# EAGLE design ffs_no_amp (EAGLE 7.2.0)
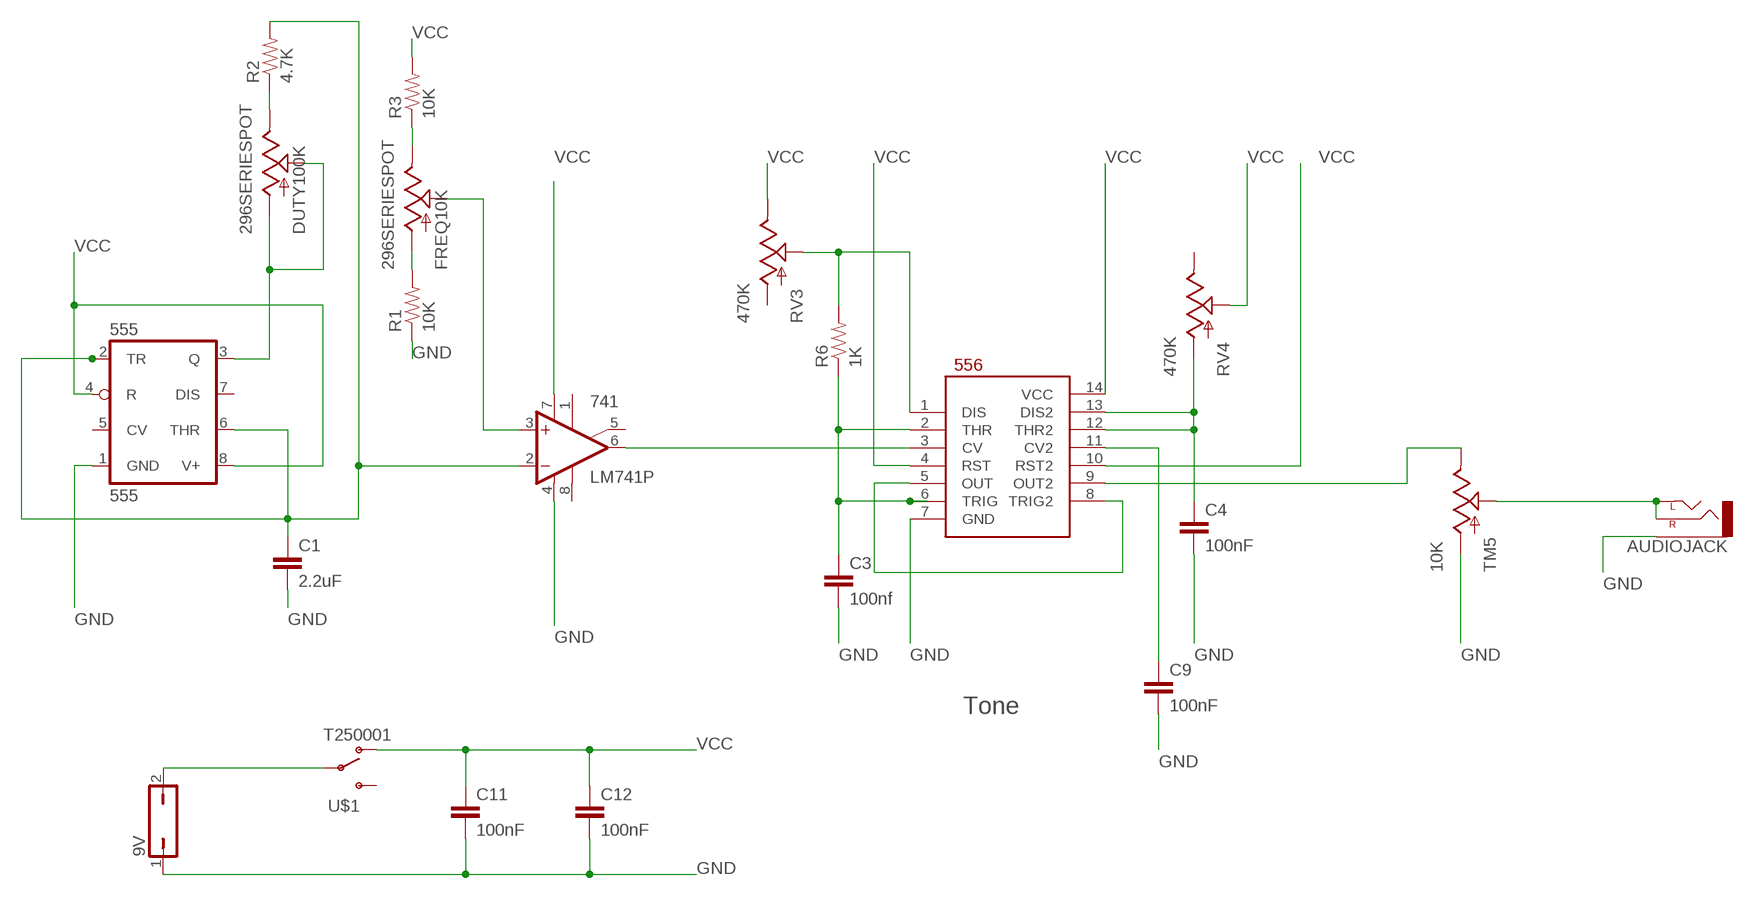
[diagram p0: schematic, sheet 1]

## Parts
9V  JP1Q  [JP1]
555  555  LM555N  [DIL08-ROUND]
556  556  [DIL14]
741  LM741P  [DIL08]
AUDIOJACK  AUDIO-JACKPTH  [AUDIO-JACK]
C1  2.2uF  CAPPTH1  [CAP-PTH-5MM]
C3  100nf  CAPPTH  [CAP-PTH-SMALL]
C4  100nF  CAPPTH  [CAP-PTH-SMALL]
C9  100nF  CAPPTH  [CAP-PTH-SMALL]
C11  100nF  CAPPTH  [CAP-PTH-SMALL]
C12  100nF  CAPPTH  [CAP-PTH-SMALL]
DUTY100K  296SERIESPOT  [296SERIESPOT]
FREQ10K  296SERIESPOT  [296SERIESPOT]
R1  10K  RESISTORPTH-1/4W  [AXIAL-0.4]
R2  4.7K  RESISTORPTH-1/4W  [AXIAL-0.4]
R3  10K  RESISTORPTH-1/4W  [AXIAL-0.4]
R6  1K  RESISTORPTH-1/4W  [AXIAL-0.4]
RV3  470K  296SERIESPOT  [296SERIESPOT]
RV4  470K  296SERIESPOT  [296SERIESPOT]
TM5  10K  296SERIESPOT  [296SERIESPOT]
U$1  T250001  [T250001]

## Nets
BATT: 9V.2 U$1.5(P)
GND: 9V.1 555.1(GND) 556.7(GND) 741.4(V-) AUDIOJACK.SLEEVE C1.2 C3.2 C4.2 C9.2 C11.2 C12.2 R1.P$1 TM5.PIN1(A)
N$1: 555.2(TR) 555.6(THR) 741.2(-IN) C1.1 R2.P$2
N$2: 556.9(OUT2) TM5.PIN3(E)
N$3: FREQ10K.PIN3(E) R3.P$1
N$4: AUDIOJACK.RING(RIGHT) AUDIOJACK.TIP(LEFT) TM5.PIN2(S)
N$5: FREQ10K.PIN1(A) R1.P$2
N$6: 556.1(DIS) R6.P$2 RV3.PIN2(S)
N$7: 556.3(CV) 741.6(OUT)
N$8: 556.2(THR) 556.6(TRIG) C3.1 R6.P$1
N$9: 556.5(OUT) 556.8(TRIG2)
N$10: 556.12(THR2) 556.13(DIS2) C4.1 RV4.PIN1(A)
N$13: 556.11(CV2) C9.1
N$14: 555.3(Q) DUTY100K.PIN1(A) DUTY100K.PIN2(S)
N$15: DUTY100K.PIN3(E) R2.P$1
N$17: 741.3(+IN) FREQ10K.PIN2(S)
VCC: 555.4(R) 555.8(V+) 556.4(RST) 556.10(RST2) 556.14(VCC) 741.7(V+) C11.1 C12.1 R3.P$2 RV3.PIN3(E) RV4.PIN2(S) U$1.4(O)
Unconnected: 555.5(CV) 555.7(DIS) 741.1(ON1) 741.5(ON2) 741.8(OPT) RV3.PIN1(A) RV4.PIN3(E) U$1.6(S)

## Notes on the sheet
- Tone

## Library data of the parts
9V = jumper:JP1Q: JUMPER
555 = adafruit:*555: TIMER Changed DIP package to have round (not oval) pin pads http://www.ladyada.net/library/pcb/eaglelibrary.html
556 = SparkFun-AnalogIC:556: Dual timer circuit (2 555 timers in one package)
741 = linear:*741: OP AMP
AUDIOJACK = SparkFun-Connectors:AUDIO-JACK: 3.5mm Audio Jack Simple 3.5mm common PCB mount audio jack. Variant PTH is our storefront SKU PRT-08032
C1 C3 C4 C9 C11 C12 = SparkFun-Capacitors:CAP: Capacitor Standard 0603 ceramic capacitor, and 0.1" leaded capacitor.
DUTY100K FREQ10K RV3 RV4 TM5 = 296seriesPOT:296SERIESPOT
R1-R3 = SparkFun-Resistors:RESISTOR: Resistor Basic schematic elements and footprints for 0603, 1206, and PTH resistors.
R6 = SparkFun-Passives:RESISTOR: Resistor Basic schematic elements and footprints for 0603, 1206, and PTH resistors.
U$1 = T250001:T250001

## Board
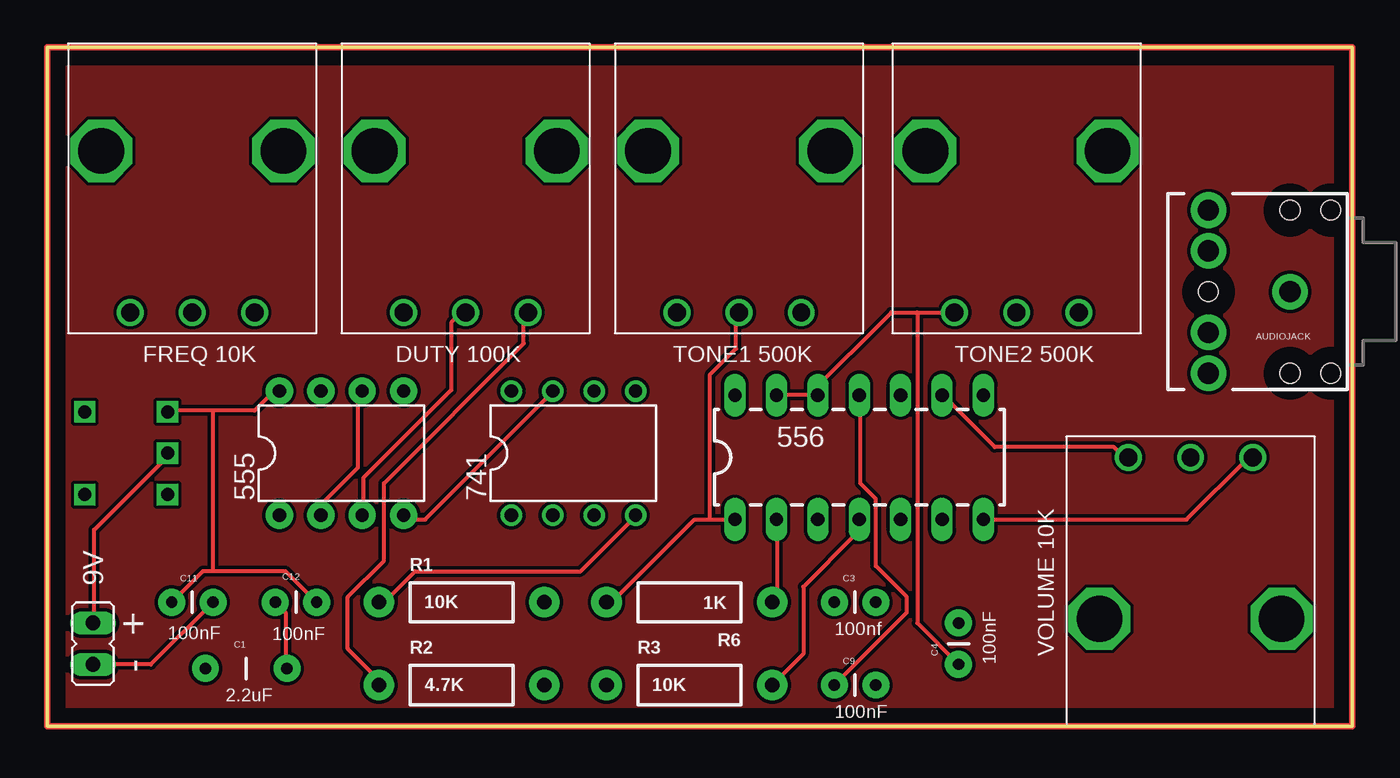
[diagram p1: board, top side]
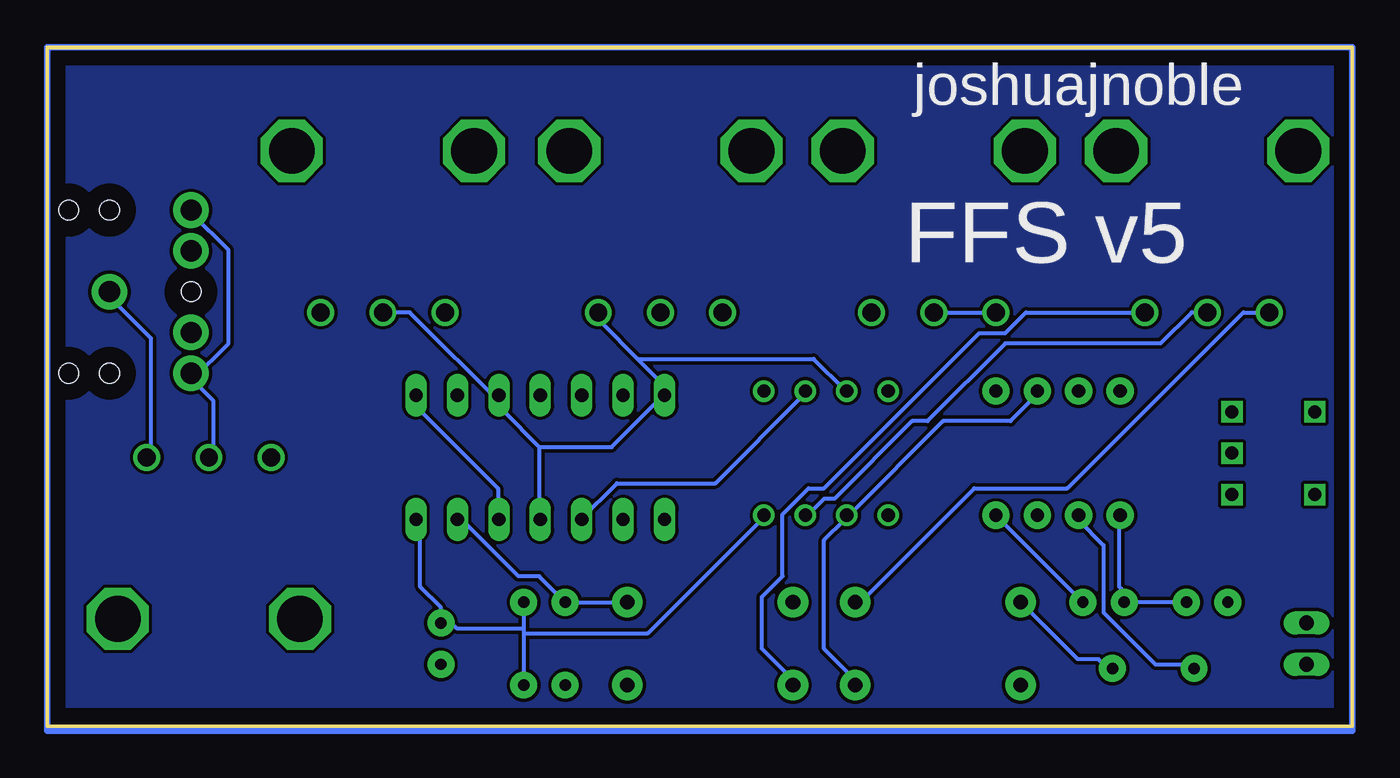
[diagram p2: board, bottom side, seen from below]

Size 80.01 x 41.66 mm. Coordinates in mm from the lower left corner, seen from the top.
Outline: 0,0 79.99,0 79.99,41.58 0,41.58 0,0
Outline: 0,0 80.01,0 80.01,41.66 0,41.66 0,0
Copper layers (1*16): Top 0.035mm / dielectric 1.5mm / Bottom 0.035mm
Design rules "default": minimum track width 10mil, minimum drill 24mil, track to track 8mil, track to pad 8mil, pad to pad 8mil, via to via 8mil, smd to smd 8mil, copper to edge 40mil, drill to drill 8mil, minimum pad ring 10mil, minimum via ring 8mil, stop-mask expansion 4mil, vias tented up to drill 0mil, thermal gap 10mil

### Footprints (pad centres in the part's own frame; a part is rotated, then mirrored left to right if it is on the bottom)
JP1 = drill 0.914 long: 1 0,-1.27; 2 0,1.27
DIL08-ROUND = drill 0.813 pad 1.676: 1 -3.81,-3.81; 2 -1.27,-3.81; 3 1.27,-3.81; 4 3.81,-3.81; 5 3.81,3.81; 6 1.27,3.81; 7 -1.27,3.81; 8 -3.81,3.81
DIL14 = drill 0.813 long: 1 -8.89,-3.81; 2 -6.35,-3.81; 3 -3.81,-3.81; 4 -1.27,-3.81; 5 1.27,-3.81; 6 3.81,-3.81; 7 6.35,-3.81; 8 6.35,3.81; 9 3.81,3.81; 10 1.27,3.81; 11 -1.27,3.81; 12 -3.81,3.81; 13 -6.35,3.81; 14 -8.89,3.81
DIL08 = drill 0.813 pad 1.27: 1 -3.81,-3.81; 2 -1.27,-3.81; 3 1.27,-3.81; 4 3.81,-3.81; 5 3.81,3.81; 6 1.27,3.81; 7 -1.27,3.81; 8 -3.81,3.81
AUDIO-JACK = drill 1.3 pad 2.184: RING 5,5; RSH 5,2.5; SLEEVE 0,0; TIP 5,-5; TSH 5,-2.5 | hole 1.2: 0,5; -2.5,5; -2.5,-5; 0,-5; 5,0
CAP-PTH-5MM = drill 0.7 pad 1.651: 1 -2.5,0; 2 2.5,0
CAP-PTH-SMALL = drill 0.7 pad 1.651: 1 0,0; 2 2.54,0
296SERIESPOT = drill 2.8 octagon: MOUNTL 9.906,-9.398; MOUNTR 9.906,1.778 | drill 1.1: PIN1 0,0; PIN2 0,-3.81; PIN3 0,-7.62
AXIAL-0.4 = drill 0.9 pad 1.88: P$1 -5.08,0; P$2 5.08,0
T250001 = drill 0.8 square: 4 5.08,0; 5 5.08,-2.54; 6 5.08,-5.08; P$1 0,0; P$2 0,-5.08

### Placement (x,y rotation side)
9V  2.79,5.08 0 top
555  18.03,16.76 0 top
556  51.05,16.51 0 top
741  32.26,16.76 0 top
AUDIOJACK  76.2,26.67 180 top
C1  12.19,3.56 0 top
C3  48.26,7.62 0 top
C4  55.88,3.81 90 top
C9  48.26,2.54 0 top
C11  7.62,7.62 0 top
C12  16.51,7.62 180 top
DUTY100K  21.84,25.4 90 top
FREQ10K  5.08,25.4 90 top
R1  25.4,7.62 0 top
R2  25.4,2.54 0 top
R3  39.37,2.54 0 top
R6  39.37,7.62 180 top
RV3  38.61,25.4 90 top
RV4  55.63,25.4 90 top
TM5  73.91,16.51 270 top
U$1  2.29,19.3 0 top

### Tracks (layer width: path | path; a pad name or v marks a point on that pad's centre or on a via)
BATT
  Top 0.254: U$1.5 7.3,16.51 2.86,12.07 2.86,6.35 9V.2
GND
  Top 0.254: R1.P$1 20.64,7.62 22.54,9.52 32.7,9.52 35.88,12.7 741.4 | 9V.1 6.35,3.81 C11.2 | C12.2 14.6,6.98 14.6,3.81 C1.2 | 556.7 69.85,12.7 73.66,16.51 TM5.PIN1
  Bottom 0.254: C11.2 13.33,7.62 | 13.33,7.62 14.29,8.57 14.29,12.7 555.1 | 13.33,7.62 C12.2 | R1.P$1 16.83,4.13 15.56,4.13 14.92,3.49 C1.2 | AUDIOJACK.SLEEVE 76.2,26.35 73.66,23.81 73.66,16.51 TM5.PIN1 | C3.2 50.8,6.03 | 50.8,6.03 50.8,5.71 | 50.8,5.71 C9.2 | 55.88,6.98 55.88,7.3 57.15,8.57 57.15,12.7 556.7 | 50.8,6.03 54.93,6.03 55.88,6.98 | 55.88,6.98 C4.2 | 50.8,5.71 43.18,5.71 36.2,12.7 741.4
N$1
  Top 0.254: 555.6 19.05,20.32 19.05,15.87 16.83,13.65 16.83,13.02 555.2
  Bottom 0.254: R2.P$2 30.48,2.86 32.38,4.76 32.38,11.43 31.11,12.7 741.2 30.8,13.02 25.08,18.73 20.96,18.73 19.37,20.32 555.6 | C1.1 9.84,3.81 12.06,3.81 15.24,6.98 15.24,11.11 16.83,12.7 555.2
N$2
  Top 0.254: 556.9 54.93,20.32 58.1,17.15 65.41,17.15 66.04,16.51 TM5.PIN3
N$3
  Bottom 0.254: FREQ10K.PIN3 20,25.4 21.27,24.13 22.86,24.13 32.38,14.6 33.34,14.6 34.92,13.02 34.92,9.21 36.2,7.94 36.2,4.76 34.29,2.86 R3.P$1
N$4
  Bottom 0.254: 71.12,21.27 71.44,21.59 AUDIOJACK.RING 71.12,21.27 | 71.12,21.27 69.85,20 69.85,16.51 TM5.PIN2 | 71.12,21.27 68.9,23.49 68.9,29.21 71.12,31.43 AUDIOJACK.TIP
N$5
  Bottom 0.254: FREQ10K.PIN1 6.67,25.4 17.46,14.6 23.18,14.6 30.16,7.62 R1.P$2
N$6
  Top 0.254: 40.64,12.7 39.69,12.7 34.61,7.62 R6.P$2 | 40.64,12.7 556.1 | 40.64,12.7 40.64,21.59 42.23,23.18 42.23,25.4 RV3.PIN2
N$7
  Bottom 0.254: 741.6 33.66,20.32 39.05,14.92 45.09,14.92 47.31,12.7 556.3
N$8
  Top 0.254: R6.P$1 44.77,7.94 44.77,12.7 556.2
  Bottom 0.254: 556.6 54.61,12.7 51.12,9.21 49.85,9.21 C3.1 R6.P$1
N$9
  Bottom 0.254: 556.5 52.39,12.7 52.39,14.6 57.15,19.37 57.15,20.32 556.8
N$10
  Top 0.254: 556.12 46.67,20.32 | 46.67,20.32 556.13 | 53.34,25.4 51.75,25.4 46.67,20.32 | 53.34,25.4 RV4.PIN1 | C4.1 53.34,6.35 53.34,25.4
N$11
  Top 0.406: 0,41.66 80.01,41.66 80.01,0 0,0 0,41.66
N$12
  Bottom 0.406: 0,41.66 80.01,41.66 80.01,-0.25 0,-0.25 0,41.66
N$13
  Top 0.254: C9.1 52.7,6.98 52.7,7.94 50.8,9.84 50.8,13.97 49.85,14.92 49.85,20.32 556.11
N$14
  Top 0.254: 555.3 19.37,13.02 19.37,15.24 24.77,20.64 24.77,24.76 25.4,25.4 DUTY100K.PIN2
  Bottom 0.254: DUTY100K.PIN2 DUTY100K.PIN1
N$15
  Top 0.254: R2.P$1 20.32,2.86 18.42,4.76 18.42,7.94 20.64,10.16 20.64,14.92 29.21,23.49 29.21,25.4 DUTY100K.PIN3
N$16
  pour Bottom: 0,41.66 80.01,41.66 80.01,0 0,0
N$17
  Bottom 0.254: FREQ10K.PIN2 9.84,25.4 11.75,23.49 21.27,23.49 26.04,18.73 26.99,18.73 31.75,13.97 32.38,13.97 33.34,13.02 741.3
N$18
  pour Top: 0,41.66 80.01,41.66 80.01,0 0,0
VCC
  Top 0.254: 741.7 30.8,20.32 23.18,12.7 21.91,12.7 555.4 | 10.16,19.37 12.7,19.37 13.97,20.64 555.8 | 10.16,19.37 7.62,19.37 U$1.4 | C11.1 9.53,9.52 10.16,9.52 | 10.16,9.52 14.6,9.52 C12.1 | 10.16,9.52 10.16,19.37 | R3.P$2 46.35,4.45 46.35,8.57 49.53,11.75 49.53,12.7 556.4
  Bottom 0.254: C12.1 555.4 | 42.23,20.32 42.23,20.96 43.81,22.54 | 43.81,22.54 46.04,24.76 46.04,25.4 RV3.PIN3 | 49.85,17.15 49.85,12.7 556.4 | 49.85,17.15 52.07,19.37 52.07,19.68 | 52.07,19.68 52.07,20.32 556.10 52.07,19.68 | RV4.PIN2 57.78,25.4 52.07,19.68 | 42.23,20.32 45.4,17.15 49.85,17.15 | 42.23,20.32 556.14 | 43.81,22.54 33.02,22.54 31.11,20.64 741.7

### Text on the board
tNames: FREQ 10K | DUTY 100K | TONE1 500K | TONE2 500K | VOLUME 10K | - +
bNames: joshuajnoble | FFS v5